# EasyEDA schematic SCH_pogo-adapter-v4_2024-10-28.json
TITLE: Sheet_2; REV: 1.0; Date: 2023-09-22; Sheet: 1/1; Drawn By: nlimper; Company: Your Company
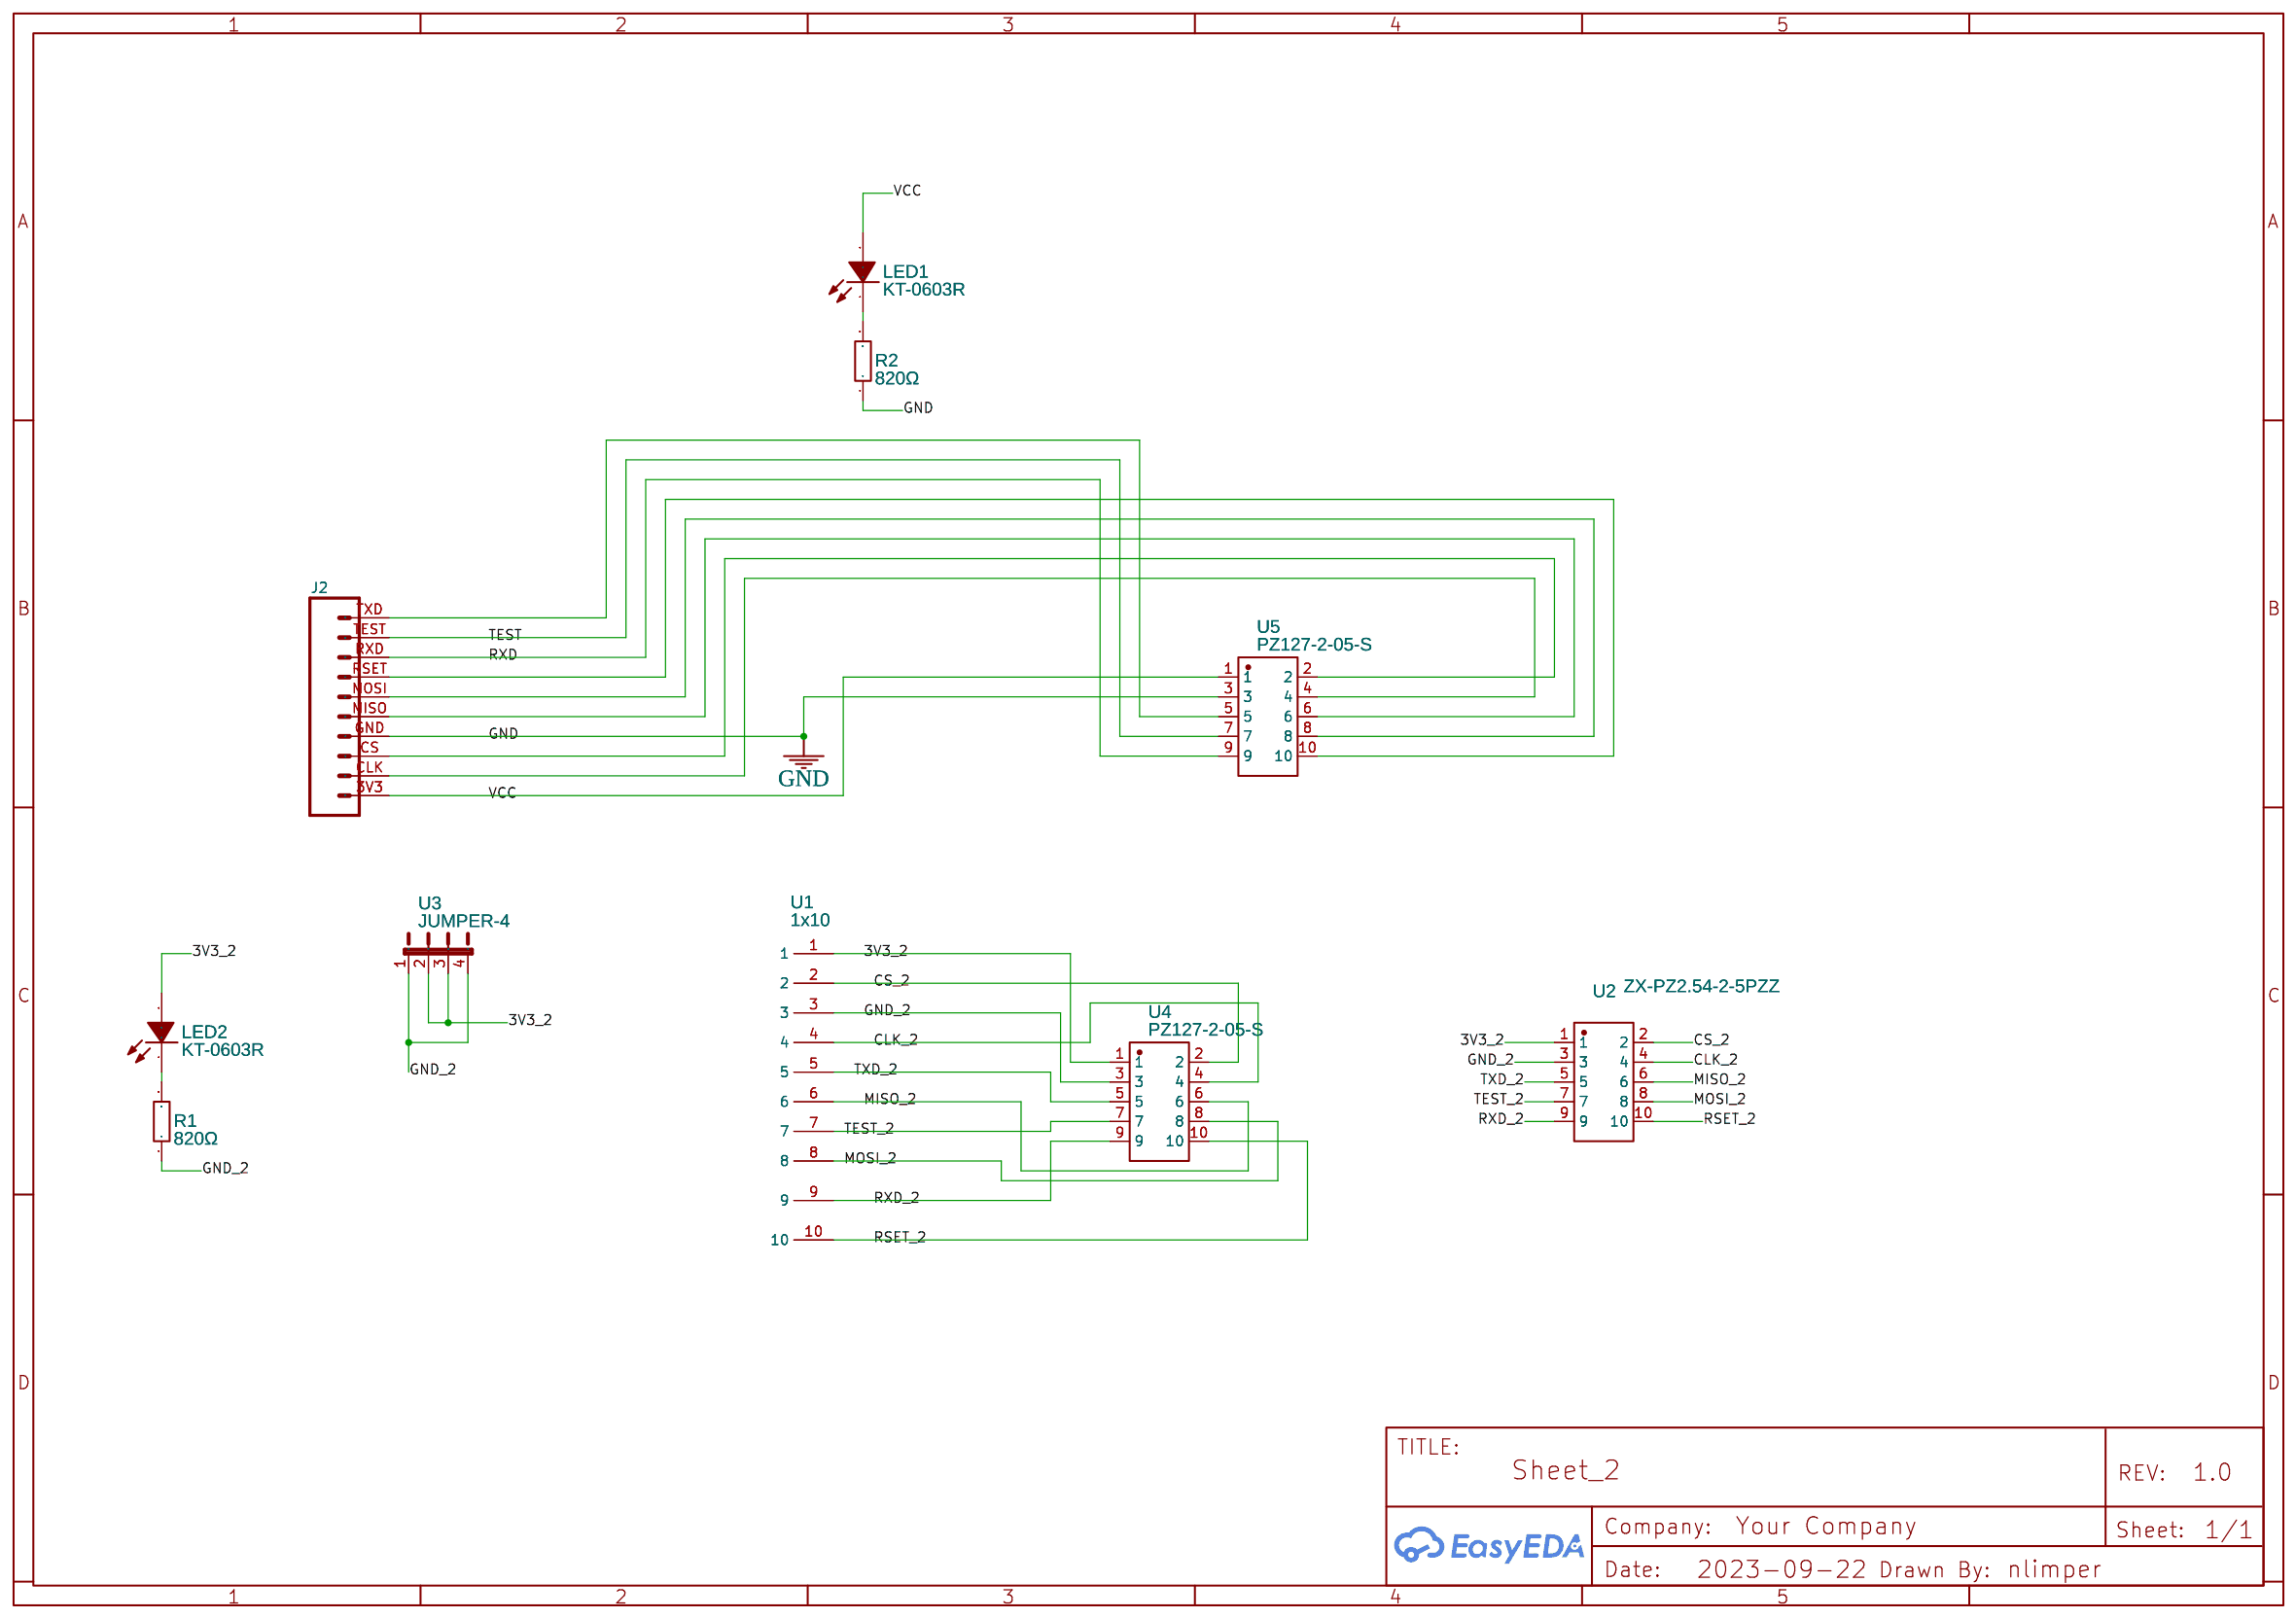
[diagram p0: schematic sheet]

## Parts
J2  SOLUM_ZBS_DEBUG  [SOLUM_ZBS_DEBUG]
LED1  KT-0603R  [LED0603-RD]
LED2  KT-0603R  [LED0603-RD]
R1  820Ω  [R0402]
R2  820Ω  [R0402]
U1  1x10  [RGL 1X10 GOLD FINGERS]
U2  ZX-PZ2.54-2-5PZZ  [HDR-TH_10P-P2.54-V-M-R2-C5-S2.54]
U3  JUMPER-4  [1X04]
U4  PZ127-2-05-S  [HDR-SMD_10P-P1.27-V-M-R2-C5-LS5.3]
U5  PZ127-2-05-S  [HDR-SMD_10P-P1.27-V-M-R2-C5-LS5.3]

## Library data of the parts
LED1 LED2 = KT-0603R: Supplier: LCSC; Manufacturer: KENTO; Supplier Part: C2286; JLCPCB Part Class: Basic Part; link: https://lcsc.com/eda_search?q=C2286&%26type=1&ref=editor
R1 R2 = 0402WGF8200TCE: Supplier: LCSC; Manufacturer: UNI-ROYAL(厚声); Supplier Part: C25135; JLCPCB Part Class: Extended Part
U1 = 1x10: Contributor: arno86
U2 = ZX-PZ2.54-2-5PZZ: Supplier: LCSC; Supplier Part: C7501276; Manufacturer: Megastar(兆星); Contributor: lcsc; JLCPCB Part Class: Extended Part
U3 = JUMPER-4: Contributor: Pinoccio
U4 U5 = PZ127-2-05-S: Supplier: LCSC; Supplier Part: C3975188; Manufacturer: HCTL(华灿天禄); Contributor: lcsc; JLCPCB Part Class: Extended Part

## Nets
3V3_2: LED2.2(A) U1.1 U2.1 U3.2 U3.3 U4.1
GND: J2.GND(4) R2.1 U5.3
GND_2: R1.1 U1.3 U2.3 U3.1 U3.4 U4.3
VCC: J2.3V3(1) LED1.2(A) U5.1
CLK_2: U1.4 U2.4 U4.4
CS_2: U1.2 U2.2 U4.2
MISO_2: U1.6 U2.6 U4.6
MOSI_2: U1.8 U2.8 U4.8
RSET_2: U1.10 U2.10 U4.10
RXD: J2.RXD(8) U5.9
RXD_2: U1.9 U2.9 U4.9
TEST: J2.TEST(9) U5.7
TEST_2: U1.7 U2.7 U4.7
TXD_2: U1.5 U2.5 U4.5
Net-(J2-CLK): J2.CLK(2) U5.4
Net-(J2-CS): J2.CS(3) U5.2
Net-(J2-MISO): J2.MISO(5) U5.6
Net-(J2-MOSI): J2.MOSI(6) U5.8
Net-(J2-RSET): J2.RSET(7) U5.10
Net-(J2-TXD): J2.TXD(10) U5.5
Net-(LED1-1): LED1.1(K) R2.2
Net-(LED2-1): LED2.1(K) R1.2
